# Altium schematic sheet Power 3.3V to mc.SchDoc
size A4; SheetNumber: 1; SheetTotal: 3
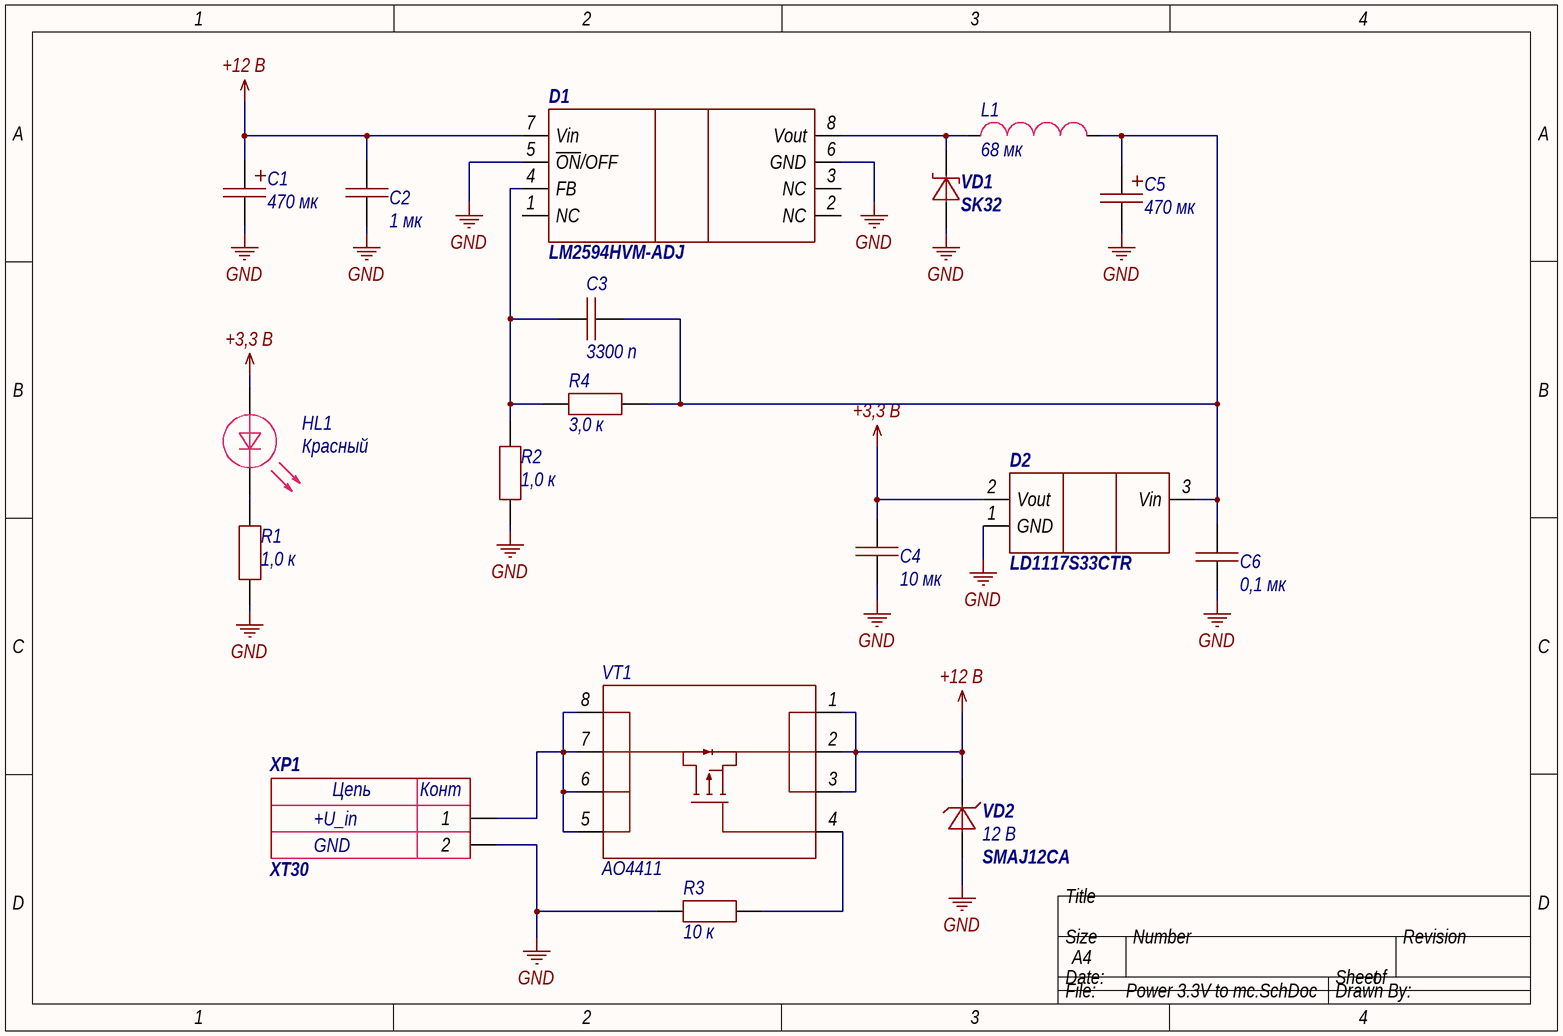
[diagram p0: Power 3.3V to mc.SchDoc]

## Parts
C1  value 470 мк  [RADIAL-2_10mm]  (hidden comment: Capacitor_polar)
C2  value 1 мк  [0603C]  (hidden comment: Capacitor)
C3  value 3300 п  [0603C]  (hidden comment: Capacitor)
C4  value 10 мк  [1210C]  (hidden comment: Capacitor)
C5  value 470 мк  [RADIAL-2_10mm]  (hidden comment: Capacitor_polar)
C6  value 0,1 мк  [0603C]  (hidden comment: Capacitor)
D1  LM2594HVM-ADJ  [SOIC-8]
D2  LD1117S33CTR  [SOT223]
HL1  Color: Красный  [0805D]  (hidden comment: LED)
L1  value 68 мк  [7.3x7.3]  (hidden comment: B82472G6683M)
R1  value 1,0 к  [0603R]  (hidden comment: Resistor)
R2  value 1,0 к  [0603R]  (hidden comment: Resistor)
R3  value 10 к  [0603R]  (hidden comment: Resistor)
R4  value 3,0 к  [0603R]  (hidden comment: Resistor)
VD1  SK32  [SMC]
VD2  SMAJ12CA  value 12 В  [SMA]
VT1  AO4411  [SOIC-8]
XP1  XT30  Value2: GND  Value1: +U_in  [XT30]

## Nets
+3,3 В: C4.1 D2.2(Vout) HL1.1
+12 В: C1.1 C2.1 D1.7(Vin) VD2.2 VT1.1 VT1.2 VT1.3
GND: C1.2 C2.2 C4.2 C5.2 C6.2 D1.5(~{ON}/OFF) D1.6(GND) D2.1(GND) R1.2 R2.1 R3.1 VD1.1 VD2.1 XP1.2
NetC3_1: C3.1 D1.4(FB) R2.2 R4.1
NetC3_2: C3.2 C5.1 C6.1 D2.3(Vin) L1.2 R4.2
NetD1_8: D1.8(Vout) L1.1 VD1.2
NetHL1_2: HL1.2 R1.1
NetR3_2: R3.2 VT1.4
NetVT1_5: VT1.5 VT1.6 VT1.7 VT1.8 XP1.1

Not connected (* = marked no-connect by the designer): D1 1(NC) 2(NC) 3(NC)

## Notes on the sheet
- (in symbol XT30) Цепь; Конт

## Library data of the parts
C1 C5 = 4,7 мк: Конденсатор электролит. 470 мкФ, 25 В, 10 мм; Part Number: Capacitor_polar
C2 = Capacitor_1u_10_50V_X7R_0603C: Конденсатор; Tolerance: 0,1; Voltage (V): 50; Dielectric: X7R; Capacity (nF): 1000; Part Number: Capacitor_1u_10_50V_X7R_0603C
C3 = Capacitor_3,3n_10_50V_X7R_0603C: Конденсатор; Tolerance: 0,1; Voltage (V): 50; Dielectric: X7R; Capacity (nF): 3,3; Part Number: Capacitor_3,3n_10_50V_X7R_0603C
C4 = Capacitor_10u_10_35V_X7R_1210C: Конденсатор; Tolerance: 0,1; Voltage (V): 35; Dielectric: X7R; Capacity (nF): 10000; Part Number: Capacitor_10u_10_35V_X7R_1210C
C6 = Capacitor_0,1u_10_50V_X7R_0603C: Конденсатор; Tolerance: 0,1; Voltage (V): 50; Dielectric: X7R; Capacity (nF): 100; Part Number: Capacitor_0,1u_10_50V_X7R_0603C
D1 = LM2594HVM-ADJ: DC-DC преобразователь; Part Number: LM2594HVM-ADJ
D2 = LD1117S33CTR: Линейный стабилизатор напряжения; Part Number: LD1117S33CTR
HL1 = LED: Светодиод; Part Number: LED
L1 = B82472G6683M: B82472G6683M, ЧИП-индуктивность экранированная 68мкГн ±20%, 0.82A, 26мОм; Part Number: B82472G6683M
R1 R2 = Resistor_1.0k_1_0603: Резистор номиналом 1,0 кОм и точностью 1%; Power: *; Part Number: Resistor_1.0k_1_0603; Tolerance: 1%
R3 = Resistor_10k_1_0603: Резистор номиналом 10 кОм и точностью 1%; Power: *; Part Number: Resistor_10k_1_0603; Tolerance: 1%
R4 = Resistor_3.0k_1_0603: Резистор номиналом 3,0 кОм и точностью 1%; Power: *; Part Number: Resistor_3.0k_1_0603; Tolerance: 1%
VD1 = SK32: Диод шоттки на 20 В, номинальный ток 3 А; Voltage nominal (V): 20; Current (A): 3; Part Number: SK32
VD2 = SMAJ12CA: Защитный диод на 12 В, рассеиваемая мощность 400 Вт; Voltage nominal (V): 12; Power (W): 400; Part Number: SMAJ12CA
VT1 = AO4411: P-канальный MOSFET; Part Number: AO4411
XP1 = XT30: 2-пиновый разъем с ключом; Part Number: XT30